# EAGLE design BitBang Rev 1 - Route 3 (EAGLE 5.11)
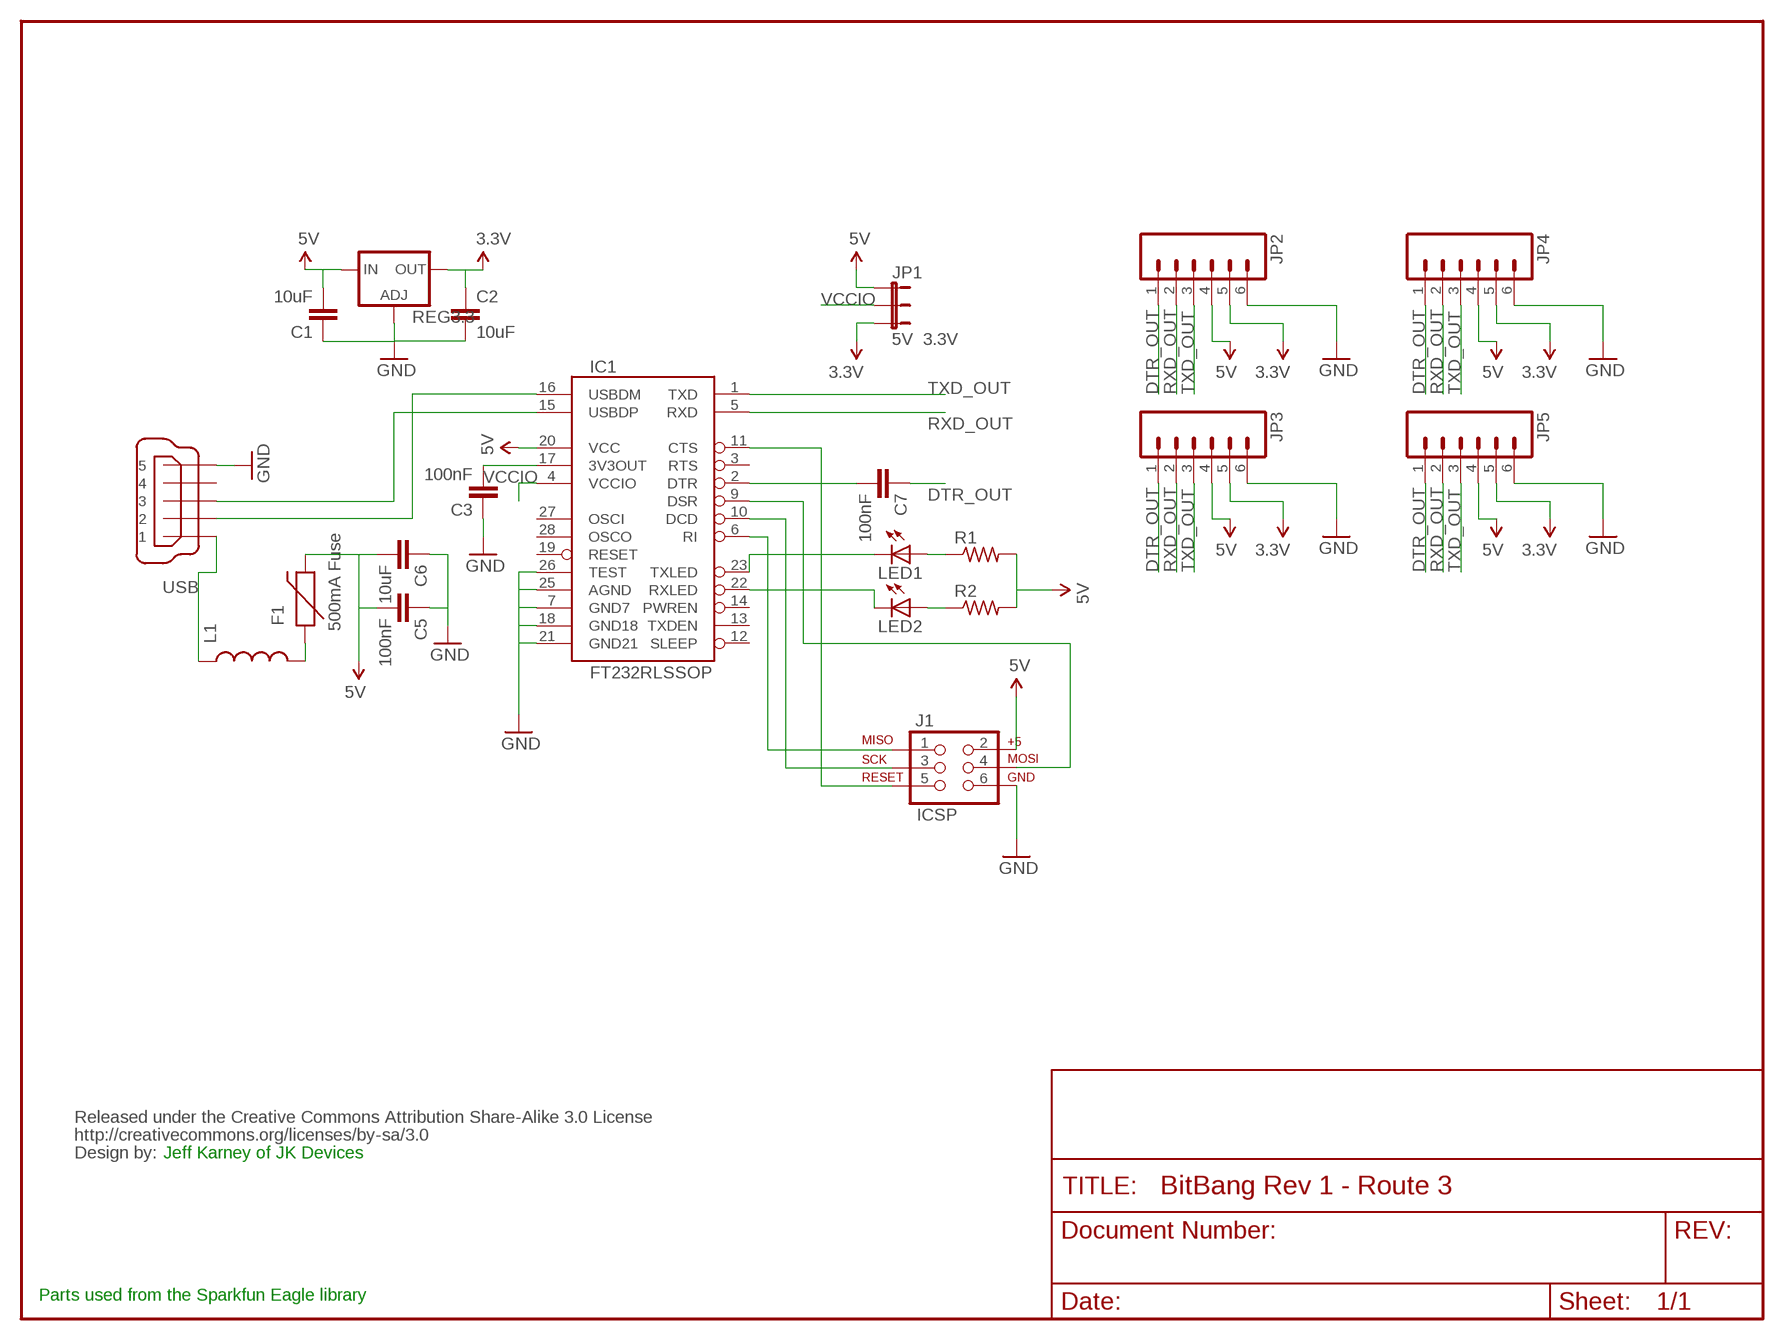
[diagram p0: schematic, sheet 1]

## Parts
C1  10uF  CAP0805  [0805]
C2  10uF  CAP0805  [0805]
C3  100nF  CAP0805  [0805]
C5  100nF  CAP0805  [0805]
C6  10uF  CAP0805  [0805]
C7  100nF  CAP0805  [0805]
F1  500mA Fuse  PTCSMD  [PTC-1206]
IC1  FT232RLSSOP  [SSOP28DB]
J1  ICSP  AVR_SPI_PRG_6NS  [2X3-NS]
JP1  5V 3.3V  JUMPER-3PTH  [1X03]
JP2  M06SIP  [1X06]
JP3  M06SIP  [1X06]
JP4  M06SIP  [1X06]
JP5  M06SIP  [1X06]
L1  INDUCTOR0805  [0805]
LED1  LEDCHIP-LED0805  [CHIP-LED0805]
LED2  LEDCHIP-LED0805  [CHIP-LED0805]
R1  R-US_R0805  [R0805]
R2  R-US_R0805  [R0805]
REG3.3  LD117AS33TR  [SOT223]
U$6  CREATIVE_COMMONS  [CREATIVE_COMMONS]
USB  MINI-USB-UX60-MB-5ST  [UX60-MB-5ST]

## Nets
3.3V: C2.1 JP1.3 JP2.5 JP3.5 JP4.5 JP5.5 REG3.3.4(OUT)
5V: C1.2 C5.2 C6.2 F1.2 IC1.20(VCC) J1.2 JP1.1 JP2.4 JP3.4 JP4.4 JP5.4 R1.2 R2.2 REG3.3.3(IN)
DTR_OUT: C7.1 JP2.1 JP3.1 JP4.1 JP5.1
GND: C1.1 C2.2 C3.1 C5.1 C6.1 IC1.7(GND7) IC1.18(GND18) IC1.21(GND21) IC1.25(AGND) IC1.26(TEST) J1.6 JP2.6 JP3.6 JP4.6 JP5.6 REG3.3.1(ADJ) USB.5
N$1: IC1.16(USBDM) USB.2
N$2: IC1.15(USBDP) USB.3
N$3: F1.1 L1.2
N$4: C7.2 IC1.2(DTR)
N$5: IC1.11(CTS) J1.5
N$6: IC1.9(DSR) J1.4
N$7: IC1.10(DCD) J1.3
N$8: C3.2 IC1.17(3V3OUT)
N$9: IC1.6(RI) J1.1
N$10: L1.1 USB.1
N$13: IC1.23(TXLED) LED1.C
N$14: IC1.22(RXLED) LED2.C
N$15: LED1.A R1.1
N$16: LED2.A R2.1
RXD_OUT: IC1.5(RXD) JP2.2 JP3.2 JP4.2 JP5.2
TXD_OUT: IC1.1(TXD) JP2.3 JP3.3 JP4.3 JP5.3
VCCIO: IC1.4(VCCIO) JP1.2
Unconnected: IC1.3(RTS) IC1.12(SLEEP) IC1.13(TXDEN) IC1.14(PWREN) IC1.19(RESET) IC1.27(OSCI) IC1.28(OSCO) USB.4

## Notes on the sheet
- Jeff Karney of JK Devices
- Parts used from the Sparkfun Eagle library

## Library data of the parts
C1-C3 C5-C7 = SparkFun:CAP: Capacitor Standard 0603 ceramic capacitor, and 0.1" leaded capacitor.
F1 = SparkFun:PTC: Resettable Fuse PTC Resettable Fuse. Spark Fun Electronics SKU : COM-08357
IC1 = SparkFun:FT232RL: USB UART FT232RL 4th Generation USB UART (USB <-> Serial) Controller. Spark Fun Electronics SKU : COM-00650
J1 = SparkFun:AVR_SPI_PRG_6: AVR ISP 6 Pin This is the reduced ISP connector for AVR programming. Common on Arduino. This footprint will take up less PCB space and can be used with a 10-pin to 6-pin adapter such as SKU: BOB-08508
JP1 = SparkFun:JUMPER-3
JP2-JP5 = SparkFun:M06: Header 6 Standard 6-pin 0.1" header. Use with straight break away headers (SKU : PRT-00116), right angle break away headers (PRT-00553), swiss pins (PRT-00743), machine pins (PRT-00117), and female headers (PRT-00115). Molex polarized connector foot print use with SKU : PRT-08094 with associated crimp pins and housings. NOTES ON THE VARIANTS LOCK and LOCK_LONGPADS... This footprint was designed to help hold the alignment of a through-hole component (i.e. 6-pin header) while soldering it into place. You may notice that each hole has been shifted either up or down by 0.005 of an inch from it's more standard position (which is a perfectly straight line). This slight alteration caused the pins (the squares in the middle) to touch the edges of the holes. Because they are alternating, it causes a "brace" to hold the component in place. 0.005 has proven to be the perfect amount of "off-center" position when using our standard breakaway headers. Although looks a little odd when you look at the bare footprint, once you have a header in there, the alteration is very hard to notice. Also, if you push a header all the way into place, it is covered up entirely on the bottom side. This idea of altering the position of holes to aid alignment will be further integrated into the Sparkfun Library for other footprints. It can help hold any component with 3 or more connection pins.
L1 = SparkFun:INDUCTOR: Inductors Basic Inductor/Choke - 0603 and 1206. Footprints are not proven and vary greatly between part numbers.
LED1 LED2 = led:LED: LED OSRAM: - CHIPLED LG R971, LG N971, LY N971, LG Q971, LY Q971, LO R971, LY R971 LH N974, LH R974 LS Q976, LO Q976, LY Q976 LO Q996 - Hyper CHIPLED LW Q18S LB Q993, LB Q99A, LB R99A - SideLED LS A670, LO A670, LY A670, LG A670, LP A670 LB A673, LV A673, LT A673, LW A673 LH A674 LY A675 LS A676, LA A676, LO A676, LY A676, LW A676 LS A679, LY A679, LG A679 - Hyper Micro SIDELED® LS Y876, LA Y876, LO Y876, LY Y876 LT Y87S - SmartLED LW L88C, LW L88S LB L89C, LB L89S, LG L890 LS L89K, LO L89K, LY L89K LS L896, LA L896, LO L896, LY L896 - TOPLED LS T670, LO T670, LY T670, LG T670, LP T670 LSG T670, LSP T670, LSY T670, LOP T670, LYG T670 LG T671, LOG T671, LSG T671 LB T673, LV T673, LT T673, LW T673 LH T674 LS T676, LA T676, LO T676, LY T676, LB T676, LH T676, LSB T676, LW T676 LB T67C, LV T67C, LT T67C, LS T67K, LO T67K, LY T67K, LW E67C LS E67B, LA E67B, LO E67B, LY E67B, LB E67C, LV E67C, LT E67C LW T67C LS T679, LY T679, LG T679 LS T770, LO T770, LY T770, LG T770, LP T770 LB T773, LV T773, LT T773, LW T773 LH T774 LS E675, LA E675, LY E675, LS T675 LS T776, LA T776, LO T776, LY T776, LB T776 LHGB T686 LT T68C, LB T68C - Hyper Mini TOPLED® LB M676 - Mini TOPLED Santana® LG M470 LS M47K, LO M47K, LY M47K Source: http://www.osram.convergy.de LUXEON: - LUMILED® LXK2-PW12-R00, LXK2-PW12-S00, LXK2-PW14-U00, LXK2-PW14-V00 LXK2-PM12-R00, LXK2-PM12-S00, LXK2-PM14-U00 LXK2-PE12-Q00, LXK2-PE12-R00, LXK2-PE12-S00, LXK2-PE14-T00, LXK2-PE14-U00 LXK2-PB12-K00, LXK2-PB12-L00, LXK2-PB12-M00, LXK2-PB14-N00, LXK2-PB14-P00, LXK2-PB14-Q00 LXK2-PR12-L00, LXK2-PR12-M00, LXK2-PR14-Q00, LXK2-PR14-R00 LXK2-PD12-Q00, LXK2-PD12-R00, LXK2-PD12-S00 LXK2-PH12-R00, LXK2-PH12-S00 LXK2-PL12-P00, LXK2-PL12-Q00, LXK2-PL12-R00 Source: www.luxeon.com KINGBRIGHT: KA-3528ASYC Source: www.kingbright.com
R1 R2 = resistor:R-US_: RESISTOR, American symbol
REG3.3 = v-reg:LD117A?*: Low drop fixed and adjustable positive voltage regulators 1 A Source: http://www.st.com/stonline/products/literature/ds/7194/ld1117axx.pdf
U$6 = SparkFun:CREATIVE_COMMONS
USB = con-hirose:MINI-USB-: MINI USB Connector Source: http://www.hirose.co.jp/cataloge_hp/e24000019.pdf; OC_FARNELL: unknown; OC_NEWARK: unknown

## Board
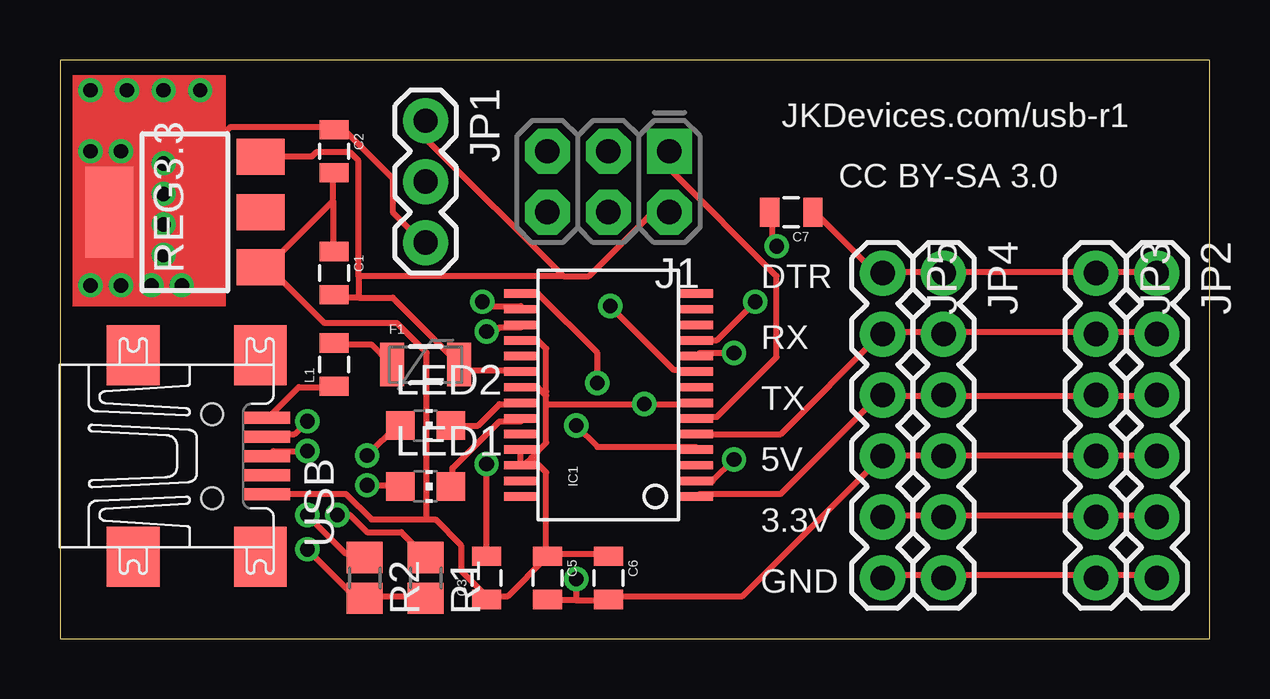
[diagram p1: board, top side]
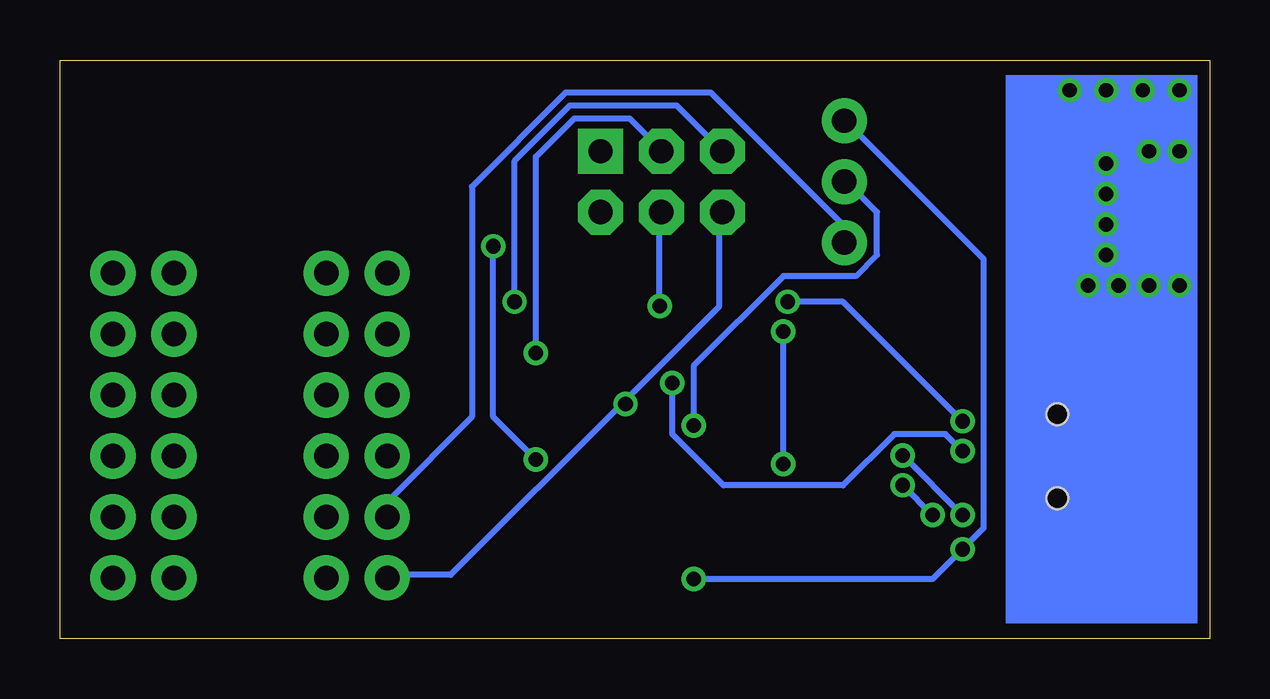
[diagram p2: board, bottom side, seen from below]

Size 47.93 x 24.12 mm. Coordinates in mm from the lower left corner, seen from the top.
Outline: 0,0 47.93,0 47.93,24.12 0,24.12 0,0
Copper layers (1*16): Top 0.0356mm / dielectric 1.5011mm / Bottom 0.0356mm
Design rules "SilverCircuits": minimum track width 7mil, minimum drill 14mil, track to track 7mil, track to pad 7mil, pad to pad 7mil, via to via 7mil, smd to smd 0mil, copper to edge 20mil, drill to drill 8mil, minimum pad ring 10mil, minimum via ring 8mil, stop-mask expansion 4mil, vias tented up to drill 0mil, thermal gap 10mil

### Footprints (pad centres in the part's own frame; a part is rotated, then mirrored left to right if it is on the bottom)
0805 = smd 0.8 x 1.2: 1 -0.9,0; 2 0.9,0
PTC-1206 = smd 1 x 1.8: 1 -1.4,0; 2 1.4,0
SSOP28DB = smd 0.348 x 1.397: 1 -4.225,-3.656; 2 -3.575,-3.656; 3 -2.925,-3.656; 4 -2.275,-3.656; 5 -1.625,-3.656; 6 -0.975,-3.656; 7 -0.325,-3.656; 8 0.325,-3.656; 9 0.975,-3.656; 10 1.625,-3.656; 11 2.275,-3.656; 12 2.925,-3.656; 13 3.575,-3.656; 14 4.225,-3.656; 15 4.225,3.656; 16 3.575,3.656; 17 2.925,3.656; 18 2.275,3.656; 19 1.625,3.656; 20 0.975,3.656; 21 0.325,3.656; 22 -0.325,3.656; 23 -0.975,3.656; 24 -1.625,3.656; 25 -2.275,3.656; 26 -2.925,3.656; 27 -3.575,3.656; 28 -4.225,3.656
2X3-NS = drill 1.016 pad 1.88 square: 1 -2.54,-1.27 | drill 1.016 pad 1.88 octagon: 2 -2.54,1.27; 3 0,-1.27; 4 0,1.27; 5 2.54,-1.27; 6 2.54,1.27
1X03 = drill 1.016 pad 1.88 round: 1 0,0; 2 2.54,0; 3 5.08,0
1X06 = drill 1.016 pad 1.88 round: 1 0,0; 2 2.54,0; 3 5.08,0; 4 7.62,0; 5 10.16,0; 6 12.7,0
CHIP-LED0805 = smd 1.2 x 1.2: A 0,-1.05; C 0,1.05
R0805 = smd 1.3 x 1.5: 1 -0.85,0; 2 0.85,0
SOT223 = smd 1.5 x 2: 1 -2.3,-3.15; 2 0,-3.15; 3 2.3,-3.15 | smd 3.8 x 2: 4 0,3.15
UX60-MB-5ST = smd 2 x 0.5: 1 2.25,1.6; 2 2.25,0.8; 3 2.25,0; 4 2.25,-0.8; 5 2.25,-1.6 | smd 2.2 x 2.5: M1 -3.3,-4.2; M2 -3.3,4.2; M3 2,4.2; M4 2,-4.2 | hole 0.9: 0,-1.75; 0,1.75

### Placement (x,y rotation side)
C1  11.43,15.24 270 top
C2  11.43,20.32 270 top
C3  17.78,2.54 90 top
C5  20.32,2.54 270 top
C6  22.86,2.54 270 top
C7  30.48,17.78 180 top
F1  15.24,11.43 0 top
IC1  22.86,10.16 90 top
J1  22.86,19.05 180 top
JP1  15.24,21.59 270 top
JP2  45.72,15.24 270 top
JP3  43.18,15.24 270 top
JP4  36.83,15.24 270 top
JP5  34.29,15.24 270 top
L1  11.43,11.43 90 top
LED1  15.24,6.35 270 top
LED2  15.24,8.89 270 top
R1  15.24,2.54 270 top
R2  12.7,2.54 270 top
REG3.3  5.21,17.78 90 top
U$6  -12.7,30.23 0 top  (outside the outline)
USB  6.35,7.62 0 top

### Tracks (layer width: path | path; a pad name or v marks a point on that pad's centre or on a via)
3.3V  (via drill 0.6)
  Top 0.254: JP5.5 34.31,5.16 36.8,5.16 JP4.5 36.98,5.16 43.03,5.16 JP3.5 43.2,5.16 45.7,5.16 JP2.5 | JP1.3 15.11,16.54 13.87,17.78 13.87,19.2 11.91,21.16 11.56,21.16 C2.1 11.38,21.34 7.11,21.34 v4.32,18.54 3.56,17.78 REG3.3.4
  Bottom 0.254: JP5.5 34.14,5.16 34.14,5.87 30.76,9.25 30.76,18.85 26.85,22.76 20.8,22.76 15.29,17.25 15.29,16.54 JP1.3
5V  (via drill 0.61)
  Top 0.254: JP2.4 45.7,7.64 43.2,7.64 JP3.4 43.03,7.64 36.98,7.64 JP4.4 36.8,7.64 34.31,7.64 JP5.4 28.45,1.78 22.94,1.78 C6.2 22.76,1.6 21.51,1.6 | 21.51,1.6 20.45,1.6 C5.2 | R1.2 15.11,1.78 12.8,1.78 R2.2 12.62,1.78 12.27,1.78 v10.31,3.73 | 12.45,14.22 13.87,14.22 16.54,11.56 F1.2 16.71,11.38 16.89,11.2 19.2,11.2 IC1.20 | 12.45,14.22 11.56,14.22 C1.2 | 12.45,15.11 12.45,14.22 | 12.45,15.11 12.45,19.91 12.09,20.27 10.67,20.27 10.49,20.09 8.36,20.09 REG3.3.3 | 20.98,15.11 12.45,15.11 | 20.98,15.11 22.05,15.11 24.71,17.78 J1.2 | 20.98,15.11 15.29,20.8 15.29,21.51 JP1.1 | v21.51,2.49 21.51,1.6
  Bottom 0.254: JP1.1 15.11,21.51 9.42,15.82 9.42,4.62 v10.31,3.73 11.56,2.49 v21.51,2.49
DTR_OUT
  Top 0.254: JP2.1 45.7,15.29 43.2,15.29 JP3.1 43.03,15.29 36.98,15.29 JP4.1 36.8,15.29 34.31,15.29 JP5.1 34.14,15.11 31.47,17.78 C7.1
GND  (via drill 0.61)
  Top 0.254: IC1.25 19.2,7.82 19.2,7.29 IC1.26 19.38,7.29 19.65,7.56 | 20.18,10.22 20.27,10.13 20.27,9.78 | 20.18,10.22 19.91,10.49 19.38,10.49 IC1.21 | 20.27,9.78 20.27,8.18 19.65,7.56 | IC1.18 19.38,12.45 19.91,12.45 20.27,12.09 20.27,10.31 20.18,10.22 | 20.27,9.78 v24.36,9.78 26.49,9.78 IC1.7 | 11.38,18.26 11.38,19.38 C2.2 | 11.38,18.26 11.38,16.18 C1.1 | 11.38,18.26 8.36,15.24 REG3.3.1 8.53,15.65 11.02,13.16 14.05,13.16 15.29,11.91 15.29,4.98 | 17.78,1.78 18.67,1.78 20.27,3.38 C5.1 | C6.1 22.76,3.56 20.45,3.56 C5.1 | 15.29,4.98 15.65,4.98 16.71,3.91 16.71,2.85 17.78,1.78 | 15.29,4.98 12.98,4.98 11.91,6.04 8.71,6.04 USB.5 | 17.78,1.78 C3.1 | 19.65,7.56 20.27,6.93 20.27,3.56 C5.1 | JP2.6 45.7,2.67 43.2,2.67 JP3.6 43.03,2.67 36.98,2.67 JP4.6 36.8,2.67 34.31,2.67 JP5.6
  Bottom 0.254: 24.45,9.87 31.65,2.67 34.14,2.67 JP5.6 | 24.45,9.87 20.45,13.87 20.45,17.78 J1.6 | v24.36,9.78 24.45,9.87
N$1  (via drill 0.61)
  Top 0.254: v17.6,14.05 17.78,13.87 19.2,13.87 IC1.16 | v10.31,9.07 9.78,8.53 8.71,8.53 USB.2
  Bottom 0.254: v17.6,14.05 15.29,14.05 v10.31,9.07
N$2  (via drill 0.61)
  Top 0.254: v22.4,10.67 22.4,11.91 19.91,14.4 19.38,14.4 IC1.15 | v10.31,7.82 8.89,7.82 8.71,7.64 USB.3
  Bottom 0.254: v22.4,10.67 22.4,8.53 20.27,6.4 15.29,6.4 13.16,8.53 11.02,8.53 v10.31,7.82
N$3
  Top 0.254: L1.2 11.56,12.27 12.98,12.27 13.69,11.56 F1.1
N$4  (via drill 0.61)
  Top 0.254: v29.87,16.36 29.69,16.54 29.69,17.78 C7.2 | v28.09,7.47 27.2,6.58 26.67,6.58 IC1.2
  Bottom 0.254: v29.87,16.36 29.87,9.25 v28.09,7.47
N$5  (via drill 0.61)
  Top 0.254: v28.98,14.05 27.38,12.45 26.67,12.45 IC1.11
  Bottom 0.254: v28.98,14.05 28.98,19.91 26.67,22.23 22.23,22.23 J1.5
N$6  (via drill 0.61)
  Top 0.254: v22.94,13.87 25.6,11.2 26.49,11.2 IC1.9
  Bottom 0.254: v22.94,13.87 22.94,17.78 J1.4
N$7  (via drill 0.61)
  Top 0.254: v28.09,11.91 26.67,11.91 IC1.10
  Bottom 0.254: v28.09,11.91 28.09,20.09 26.49,21.69 24.18,21.69 22.94,20.45 J1.3
N$8  (via drill 0.61)
  Top 0.254: v17.78,12.8 18.14,12.8 18.31,12.98 19.2,12.98 IC1.17 | C3.2 v17.78,7.29
  Bottom 0.254: v17.78,7.29 v17.78,12.8
N$9
  Top 0.254: IC1.6 26.67,9.25 27.38,9.25 29.87,11.73 29.87,15.11 25.43,19.56 25.43,20.27 J1.1
N$10
  Top 0.254: L1.1 11.38,10.49 9.96,10.49 8.71,9.25 USB.1
N$11  (via drill 0.6)
  other vias: 1.27,22.86
N$12  (via drill 0.6)
  other vias: 2.79,22.86
N$13
  Top 0.254: LED1.C 16.36,6.4 16.36,7.11 18.31,9.07 19.2,9.07 IC1.23
N$14
  Top 0.254: LED2.C 17.42,8.89 18.31,9.78 19.2,9.78 IC1.22
N$15  (via drill 0.61)
  Top 0.254: v12.8,6.4 14.05,6.4 LED1.A | v11.56,5.16 12.09,5.16 12.8,4.45 14.22,4.45 15.11,3.56 R1.1
  Bottom 0.254: v11.56,5.16 v12.8,6.4
N$16  (via drill 0.61)
  Top 0.254: v12.8,7.64 14.05,8.89 LED2.A | v10.31,5.16 11.91,3.56 12.62,3.56 R2.1
  Bottom 0.254: v10.31,5.16 v12.8,7.64
N$17  (via drill 0.6)
  other vias: 4.32,22.86
N$18  (via drill 0.6)
  other vias: 5.84,22.86
N$19  (via drill 0.6)
  other vias: 1.27,14.73
N$20  (via drill 0.6)
  other vias: 2.54,14.73
N$21  (via drill 0.6)
  other vias: 3.81,14.73
N$22  (via drill 0.6)
  other vias: 5.08,14.73
N$23  (via drill 0.6)
  other vias: 2.54,20.32
N$24  (via drill 0.6)
  other vias: 1.27,20.32
N$25  (via drill 0.6)
  other vias: 4.32,19.81
N$26  (via drill 0.6)
  other vias: 4.32,17.27
N$27  (via drill 0.6)
  other vias: 4.32,16
RXD_OUT
  Top 0.254: JP2.2 45.7,12.8 43.2,12.8 JP3.2 43.03,12.8 36.98,12.8 JP4.2 36.8,12.8 34.31,12.8 JP5.2 34.14,12.62 30.05,8.53 26.67,8.53 IC1.5
TXD_OUT
  Top 0.254: JP2.3 45.7,10.13 43.2,10.13 JP3.3 43.03,10.13 36.98,10.13 JP4.3 36.8,10.13 34.31,10.13 JP5.3 34.14,10.13 30.05,6.04 26.67,6.04 IC1.1
VCCIO  (via drill 0.61)
  Top 0.254: v21.51,8.89 22.4,8 26.49,8 IC1.4
  Bottom 0.254: v21.51,8.89 21.51,11.38 17.78,15.11 14.76,15.11 13.87,16 13.87,17.78 15.11,19.02 JP1.2
(copper drawn outside any net)
  shapes: Bottom area x1, Top area x1

### Text on the board
tPlace: Jeff Karney of JK Devices
tNames: JKDevices.com/usb-r1 | CC BY-SA 3.0 | DTR | RX | TX | 5V | 3.3V | GND